# Altium schematic sheet MCU.SchDoc
size A4; SheetNumber: 1; SheetTotal: 3
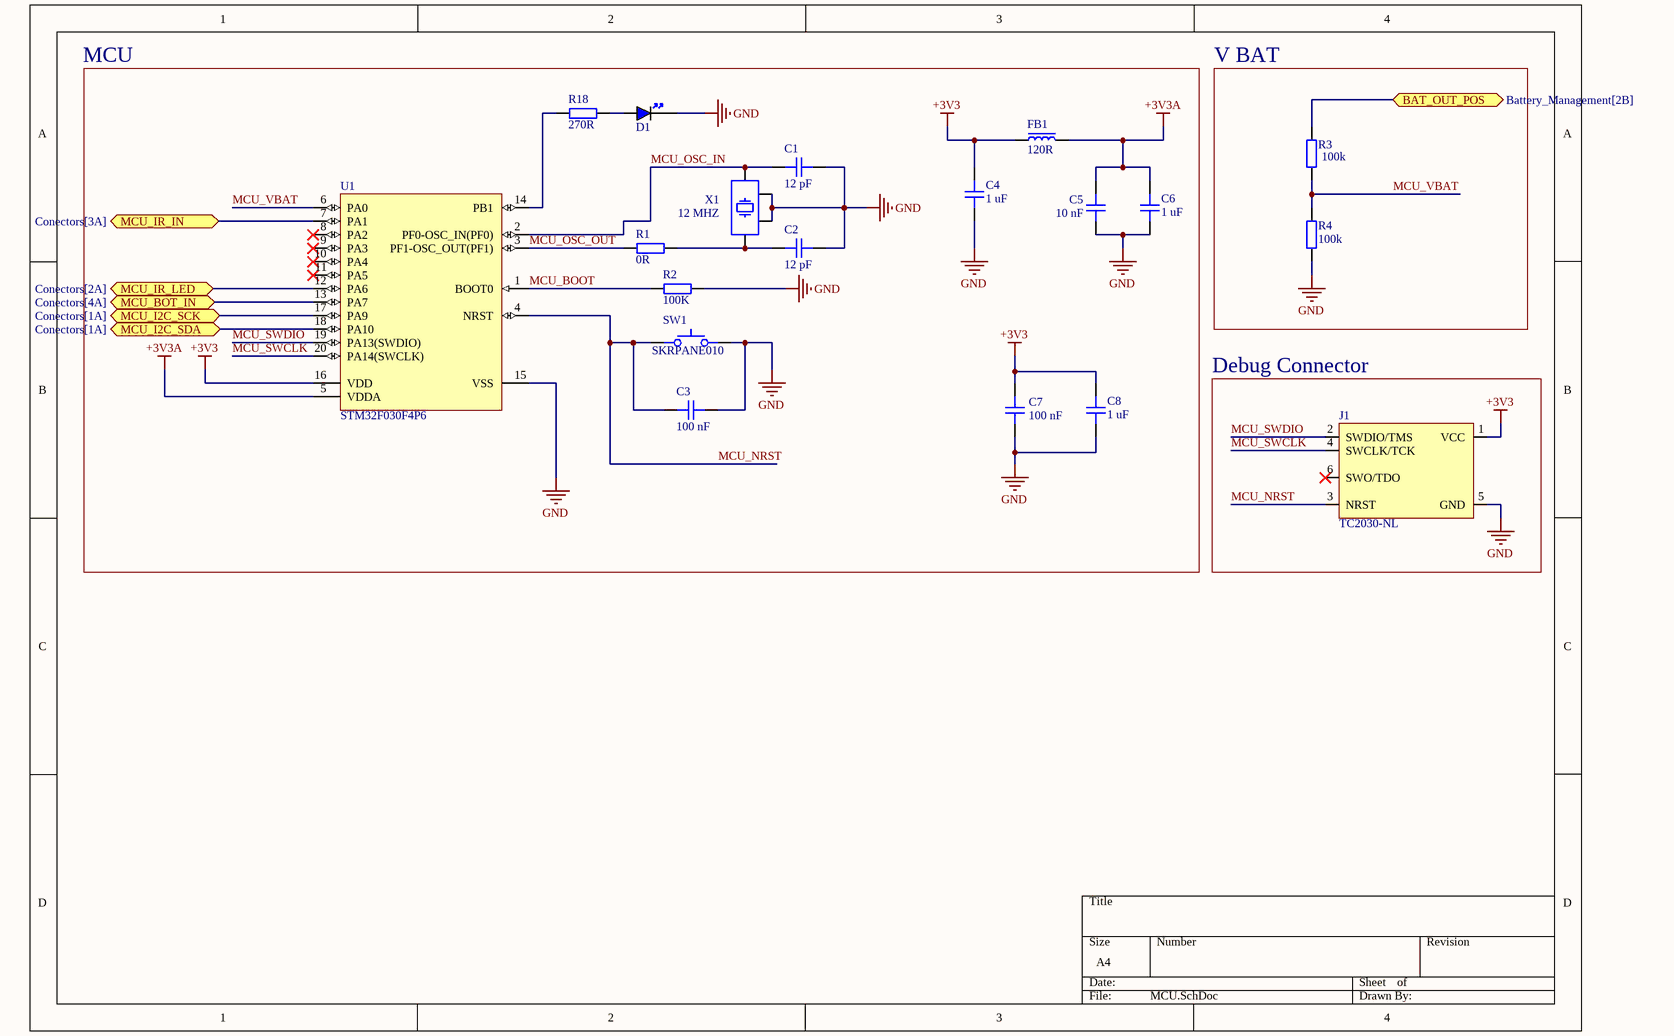
[diagram p0: MCU.SchDoc]

## Parts
C1  12 pF  [CAP_0402]
C2  12 pF  [CAP_0402]
C3  100 nF  [CAP_0402]
C4  1 uF  [CAP_0805]
C5  10 nF  [CAP_0402]
C6  1 uF  [CAP_0805]
C7  100 nF  [CAP_0402]
C8  1 uF  [CAP_0805]
D1  BLUE  [LED_0805_BLUE]  (value not drawn)
FB1  120R  [FB_0805]
J1  TC2030-NL  [TC2030-NL-FP]  (no BOM)
R1  0R  [RES_0402]
R2  100K  [RES_0402]
R3  100k  [RES_0603]
R4  100k  [RES_0603]
R18  270R  [RES_0402]
SW1  SKRPANE010  [SKRPANE010]
U1  STM32F030F4P6  [STM-TSSOP20_L]
X1  12 MHZ  [XTAL_2520]

## Blocks framed on the sheet
MCU: C1-C8 D1 FB1 R1 R2 R18 SW1 U1 X1
V BAT: R3 R4
Debug Connector: J1

## Ports
BAT_OUT_POS (bidir, see Battery_Management[2B]), MCU_BOT_IN (bidir, see Conectors[4A]), MCU_I2C_SCK (bidir, see Conectors[1A]), MCU_I2C_SDA (bidir, see Conectors[1A]), MCU_IR_IN (bidir, see Conectors[3A]), MCU_IR_LED (bidir, see Conectors[2A])

## Nets
+3V3: C4.2 C7.2 C8.2 FB1.1 J1.1(VCC) U1.16(VDD)
+3V3A: C5.2 C6.2 FB1.2 U1.5(VDDA)
GND: C1.2 C2.2 C3.2 C4.1 C5.1 C6.1 C7.1 C8.1 D1.K J1.5(GND) R2.2 R4.1 SW1.34 U1.15(VSS) X1.2 X1.4
BAT_OUT_POS: R3.2 ; port BAT_OUT_POS
MCU_BOOT: R2.1 U1.1(BOOT0)
MCU_BOT_IN: U1.13(PA7) ; port MCU_BOT_IN
MCU_I2C_SCK: U1.17(PA9) ; port MCU_I2C_SCK
MCU_I2C_SDA: U1.18(PA10) ; port MCU_I2C_SDA
MCU_IR_IN: U1.7(PA1) ; port MCU_IR_IN
MCU_IR_LED: U1.12(PA6) ; port MCU_IR_LED
MCU_NRST: C3.1 J1.3(NRST) SW1.12 U1.4(NRST)
MCU_OSC_IN: C1.1 U1.2(PF0-OSC_IN(PF0)) X1.3
MCU_OSC_OUT: R1.1 U1.3(PF1-OSC_OUT(PF1))
MCU_SWCLK: J1.4(SWCLK/TCK) U1.20(PA14(SWCLK))
MCU_SWDIO: J1.2(SWDIO/TMS) U1.19(PA13(SWDIO))
MCU_VBAT: R3.1 R4.2 U1.6(PA0)
NetC2_1: C2.1 R1.2 X1.1
NetD1_A: D1.A R18.2
NetR18_1: R18.1 U1.14(PB1)

Not connected (* = marked no-connect by the designer): J1 6(SWO/TDO)*; U1 8(PA2)* 9(PA3)* 10(PA4)* 11(PA5)*

## Notes on the sheet
- THIS DOCUMENT AND THE DATA DISCLOSED HEREIN OR
- HEREWITH IS THE PROPERTY OF ALTIUM LIMITED AND MAY
- DWG NO:
- REVISION
- REV:
- DESCRIPTION
- DATE
- APPROVED
- BE FREELY DISTRIBUTED IN WHOLE. NO RIGHTS ARE
- RESERVED OR EXPRESS OR IMPLIED WARANTEE GIVEN.
- ENG:
- APPROVALS
- PROJECT
- DSN:
- CHK:
- REFERENCE DOCUMENTS
- PROJECT REVISION:
- TITLE
- DOCUMENT REVISION:
- DESIGN ITEM:
- BOM:
- FAB DWG:
- PCB DWG:
- ASSY DWG:
- SCALE:
- A3
- SIZE
- CAGE CODE
- FILE NAME
- DWG NO.
- SHEET
- OF
- REV

## Library data of the parts
C1-C3 C5 C7 = CAP_0402: Capacitor SMD 0402; Manufacturer: *; Manufacturer Part Number: *; Distributor Link: *; LCSC: *; Rating: *; Dielectric: *
C4 C6 C8 = CAP_0805: Capacitor SMD 0805; Manufacturer: *; Manufacturer Part Number: *; Distributor Link: *; LCSC: *; Rating: *; Dielectric: *
D1 = LED_0805_BLUE: LED 0805 BLUE SMD; Manufacturer: *; Manufacturer Part Number: *; Distributor Link: *; LCSC: *
FB1 = FB_0805: Ferrite Bead SMD 0805GZ2012D121TF; Manufacturer Part Number: PZ2012D121-3R0TF; Manufacturer: *; Distributor Link: *; LCSC: *
J1 = TC2030-NL: Tag-Connect No-Solder SWD Debug Connector (No Legs) DO NOT PLACE; Manufacturer: Tag-Connect; Manufacturer Part Number: TC2030-NL-FP
R1 R2 R18 = RES_0402: Resistor SMD 0402; Manufacturer: *; Manufacturer Part Number: *; Distributor Link: *; LCSC: *
R3 R4 = RES_0603: Resistor SMD 0603; Manufacturer: *; Manufacturer Part Number: *; Distributor Link: *; LCSC: *
SW1 = SKRPANE010: Tactile Switch SMD SPST; Manufacturer: Alps Alpine; Manufacturer Part Number: SKRPANE010
U1 = CMP-0304-00039-2: ARM Cortex-M0 32-bit MCU, 16 KB Flash, 4 KB Internal RAM, 15 I/Os, 20-pin TSSOP, -40 to 85 degC, Tube; I/Os (High Current): 15; FLASH Size (Prog) (kB): 16; Internal RAM Size (kB): 4; Supply Voltage(Vcc) min (V): 2.4; Operating Frequency(F) (Processor speed) (MHz): 48; ComponentLink2URL: http://www.st.com/st-web-ui/static/active/en/resource/technical/document/datasheet/DM00088500.pdf; Core: ARM Cortex-M0; ComponentLink2Description: Datasheet; PackageDescription: 20-Pin Thin Shrink Small Outline Package, 6.5 x 4.4 mm Body, 0.65 mm Pitch; Mounting Technology: Surface Mount; ComponentLink1URL: http://www.st.com/web/en/home.html; PackageVersion: Rev. 1, 11/2012; ComponentLink3Description: Package Specification; PartNumber: STM32F030F4P6; ComponentLink3URL: http://www.st.com/st-web-ui/static/active/en/resource/technical/document/datasheet/DM00065136.pdf; DatasheetVersion: Rev. 1; PackageReference: TSSOP20; ComponentLink1Description: Manufacturer URL; Packing: Tube
X1 = XTAL_2520: Crystal SMD 2520; Manufacturer Part Number: HY12MSMD2520FA1R30; Distributor Link: *